# Altium schematic sheet PMI_Action_Octopus.SchDoc
size A4
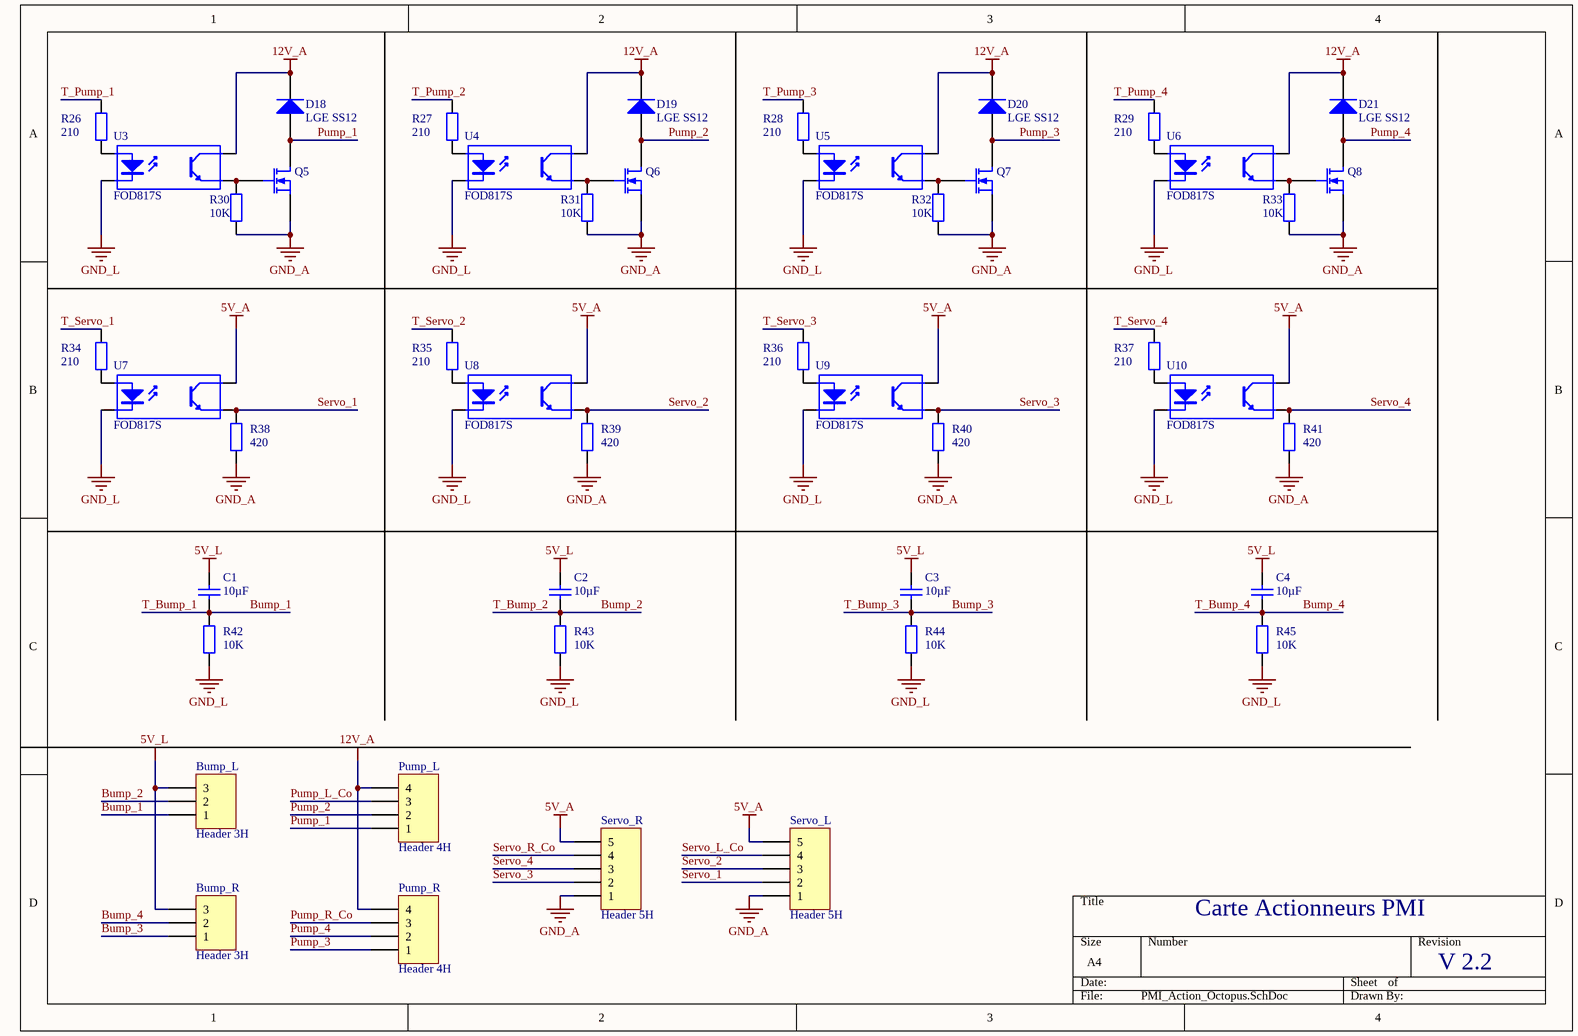
[diagram p0: PMI_Action_Octopus.SchDoc]

## Parts
Bump_L  Header 3H  [S3B-XH-A]
Bump_R  Header 3H  [S3B-XH-A]
C1  value 10µF  [Capacitor 1206]
C2  value 10µF  [Capacitor 1206]
C3  value 10µF  [Capacitor 1206]
C4  value 10µF  [Capacitor 1206]
D18  LGE SS12  [SMB]
D19  LGE SS12  [SMB]
D20  LGE SS12  [SMB]
D21  LGE SS12  [SMB]
Pump_L  Header 4H  [S4B-XH-A]
Pump_R  Header 4H  [S4B-XH-A]
Q5  MOSFET-N  [SOT23_M]  (value not drawn)
Q6  MOSFET-N  [SOT23_M]  (value not drawn)
Q7  MOSFET-N  [SOT23_M]  (value not drawn)
Q8  MOSFET-N  [SOT23_M]  (value not drawn)
R26  value 210  [Resistor 1206]  (hidden comment: Res2)
R27  value 210  [Resistor 1206]  (hidden comment: Res2)
R28  value 210  [Resistor 1206]  (hidden comment: Res2)
R29  value 210  [Resistor 1206]  (hidden comment: Res2)
R30  value 10K  [Resistor 1206]  (hidden comment: Res2)
R31  value 10K  [Resistor 1206]  (hidden comment: Res2)
R32  value 10K  [Resistor 1206]  (hidden comment: Res2)
R33  value 10K  [Resistor 1206]  (hidden comment: Res2)
R34  value 210  [Resistor 1206]  (hidden comment: Res2)
R35  value 210  [Resistor 1206]  (hidden comment: Res2)
R36  value 210  [Resistor 1206]  (hidden comment: Res2)
R37  value 210  [Resistor 1206]  (hidden comment: Res2)
R38  value 420  [Resistor 1206]  (hidden comment: Res2)
R39  value 420  [Resistor 1206]  (hidden comment: Res2)
R40  value 420  [Resistor 1206]  (hidden comment: Res2)
R41  value 420  [Resistor 1206]  (hidden comment: Res2)
R42  value 10K  [Resistor 1206]  (hidden comment: Res2)
R43  value 10K  [Resistor 1206]  (hidden comment: Res2)
R44  value 10K  [Resistor 1206]  (hidden comment: Res2)
R45  value 10K  [Resistor 1206]  (hidden comment: Res2)
Servo_L  Header 5H  [S5B-XH-A]
Servo_R  Header 5H  [S5B-XH-A]
U3  FOD817S  [SOP254P1016X385-4N]
U4  FOD817S  [SOP254P1016X385-4N]
U5  FOD817S  [SOP254P1016X385-4N]
U6  FOD817S  [SOP254P1016X385-4N]
U7  FOD817S  [SOP254P1016X385-4N]
U8  FOD817S  [SOP254P1016X385-4N]
U9  FOD817S  [SOP254P1016X385-4N]
U10  FOD817S  [SOP254P1016X385-4N]

## Nets
5V_A: Servo_L.5 Servo_R.5 U7.4(C) U8.4(C) U9.4(C) U10.4(C)
5V_L: Bump_L.3 Bump_R.3 C1.2 C2.2 C3.2 C4.2
12V_A: D18.2(K) D19.2(K) D20.2(K) D21.2(K) Pump_L.4 Pump_R.4 U3.4(C) U4.4(C) U5.4(C) U6.4(C)
GND_A: Q5.3(S) Q6.3(S) Q7.3(S) Q8.3(S) R30.1 R31.1 R32.1 R33.1 R38.1 R39.1 R40.1 R41.1 Servo_L.1 Servo_R.1
GND_L: R42.1 R43.1 R44.1 R45.1 U3.2(K) U4.2(K) U5.2(K) U6.2(K) U7.2(K) U8.2(K) U9.2(K) U10.2(K)
Bump_1: Bump_L.1 C1.1 R42.2  [also labelled T_Bump_1]
Bump_2: Bump_L.2 C2.1 R43.2  [also labelled T_Bump_2]
Bump_3: Bump_R.1 C3.1 R44.2  [also labelled T_Bump_3]
Bump_4: Bump_R.2 C4.1 R45.2  [also labelled T_Bump_4]
Pump_1: D18.1(A) Pump_L.1 Q5.1(D)
Pump_2: D19.1(A) Pump_L.2 Q6.1(D)
Pump_3: D20.1(A) Pump_R.1 Q7.1(D)
Pump_4: D21.1(A) Pump_R.2 Q8.1(D)
Pump_L_Co: Pump_L.3
Pump_R_Co: Pump_R.3
Servo_1: R38.2 Servo_L.2 U7.3(E)
Servo_2: R39.2 Servo_L.3 U8.3(E)
Servo_3: R40.2 Servo_R.2 U9.3(E)
Servo_4: R41.2 Servo_R.3 U10.3(E)
Servo_L_Co: Servo_L.4
Servo_R_Co: Servo_R.4
T_Pump_1: R26.2
T_Pump_2: R27.2
T_Pump_3: R28.2
T_Pump_4: R29.2
T_Servo_1: R34.2
T_Servo_2: R35.2
T_Servo_3: R36.2
T_Servo_4: R37.2
NetQ5_2: Q5.2(G) R30.2 U3.3(E)
NetQ6_2: Q6.2(G) R31.2 U4.3(E)
NetQ7_2: Q7.2(G) R32.2 U5.3(E)
NetQ8_2: Q8.2(G) R33.2 U6.3(E)
NetR26_1: R26.1 U3.1(A)
NetR27_1: R27.1 U4.1(A)
NetR28_1: R28.1 U5.1(A)
NetR29_1: R29.1 U6.1(A)
NetR34_1: R34.1 U7.1(A)
NetR35_1: R35.1 U8.1(A)
NetR36_1: R36.1 U9.1(A)
NetR37_1: R37.1 U10.1(A)

## Notes on the sheet
- Carte Actionneurs PMI
- V 2.2

## Library data of the parts
Bump_L Bump_R = Header 3H: Header, 3-Pin, Right Angle; LatestRevisionDate: 17-Jul-2002; LatestRevisionNote: Re-released for DXP Platform.; Publisher: Altium Limited
C1-C4 = Cap: Capacitor; Published: 8-Jun-2000; LatestRevisionDate: 17-Jul-2002; LatestRevisionNote: Re-released for DXP Platform.; PackageReference: RAD-0.3; Publisher: Altium Limited; PackageDescription: Radial Cap, Thru-Hole; 2 Leads; 0.3 in Pin Spacing
D18-D21 = Diode: Default Diode; Published: 8-Jun-2000; LatestRevisionDate: 17-Jul-2002; LatestRevisionNote: Re-released for DXP Platform.; PackageVersion: Sep-1996; PackageReference: SMC; Publisher: Altium Limited; PackageDescription: DO-214-AB/SMC; 2 C-Bend Leads; Body 7.9 x 5.9 mm, inc. leads (LxW); Code_JEDEC: DO-214-AB
Pump_L Pump_R = Header 4H: Header, 4-Pin, Right Angle; LatestRevisionDate: 17-Jul-2002; LatestRevisionNote: Re-released for DXP Platform.; Publisher: Altium Limited
Q5-Q8 = MOSFET-N: N-Channel MOSFET; pin to pad: 2>3 3>2; Published: 8-Jun-2000; LatestRevisionDate: 17-Jul-2002; LatestRevisionNote: Re-released for DXP Platform.; PackageVersion: 1995/1996; PackageReference: E3; Publisher: Altium Limited; PackageDescription: TO, Flat Index; 3 In-Line, Axial Leads; Body Dia. 4.6mm; Lead Dia. 0.5 mm (max)
R26-R45 = Res2: Resistor; Published: 8-Jun-2000; LatestRevisionDate: 17-Jul-2002; LatestRevisionNote: Re-released for DXP Platform.; PackageReference: AXIAL-0.4; Publisher: Altium Limited; PackageDescription: Axial Device, Thru-Hole; 2 Leads; 0.4 in Pin Spacing
Servo_L Servo_R = Header 5H: Header, 5-Pin, Right Angle; LatestRevisionDate: 17-Jul-2002; LatestRevisionNote: Re-released for DXP Platform.; Publisher: Altium Limited
U3-U10 = Optoisolator1: 4-Pin Phototransistor Optocoupler; Published: 24-Mar-1999; LatestRevisionDate: 04-Mar-2005; LatestRevisionNote: Sch pins 3 & 4 Swapped.; DatasheetVersion: Nov-2003; PackageReference: DIP-4; Publisher: Altium Limited